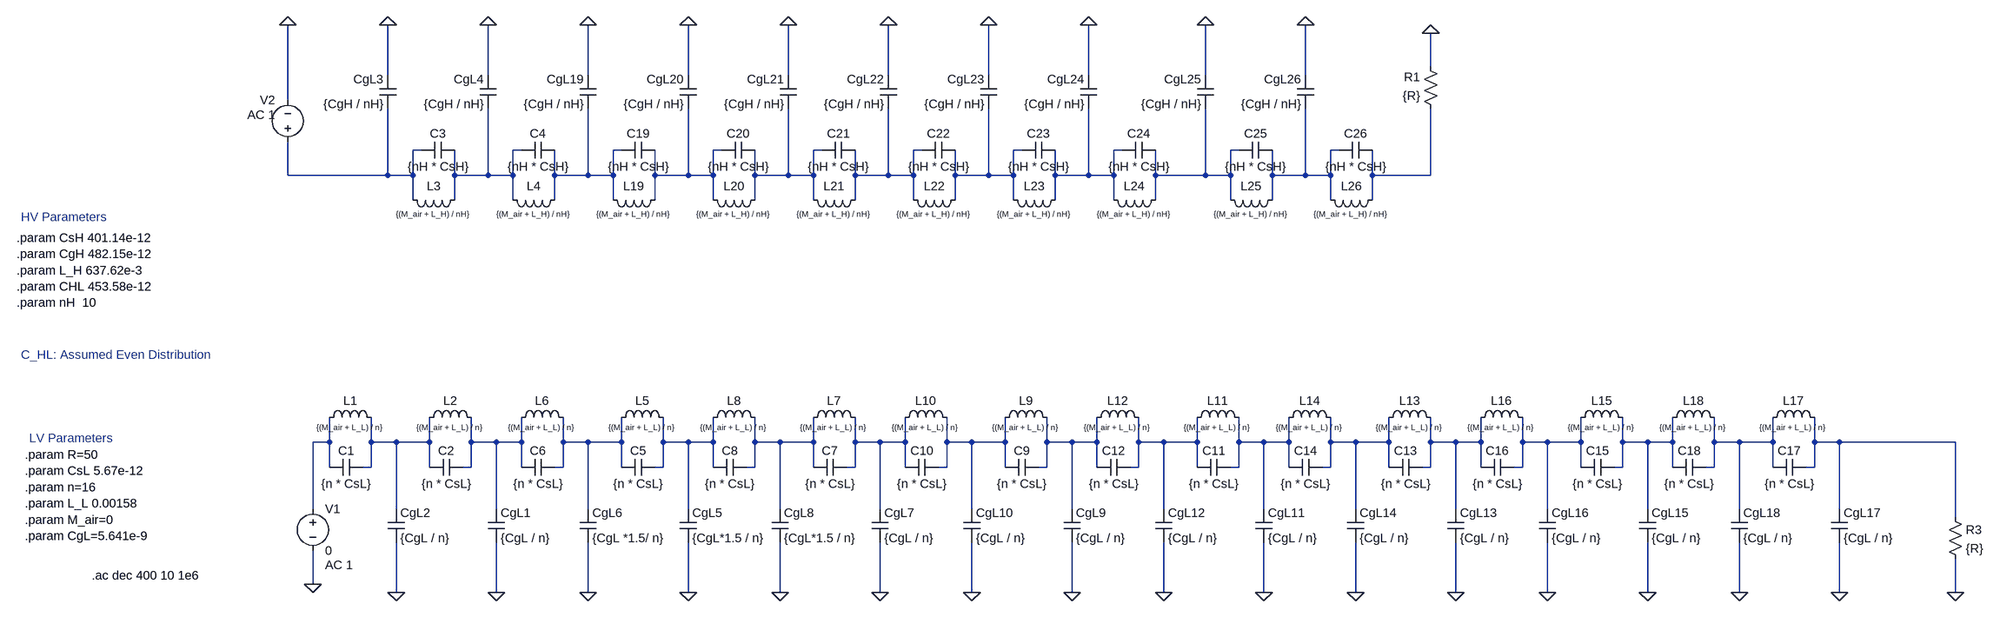
[diagram p0: schematic lumped_network_Radialbase.asc]
lumped_network_Radialbase.asc, the LTspice schematic file:
Version 4.1
SHEET 1 4096 1028
WIRE 2608 -576 2608 -640
WIRE 608 -560 608 -656
WIRE 800 -560 800 -656
WIRE 992 -560 992 -656
WIRE 1184 -560 1184 -656
WIRE 1376 -560 1376 -656
WIRE 1568 -560 1568 -656
WIRE 1760 -560 1760 -656
WIRE 1952 -560 1952 -656
WIRE 2176 -560 2176 -656
WIRE 2368 -560 2368 -656
WIRE 416 -512 416 -656
WIRE 672 -416 656 -416
WIRE 864 -416 848 -416
WIRE 1056 -416 1040 -416
WIRE 1248 -416 1232 -416
WIRE 1440 -416 1424 -416
WIRE 1632 -416 1616 -416
WIRE 1824 -416 1808 -416
WIRE 2016 -416 2000 -416
WIRE 2240 -416 2224 -416
WIRE 2432 -416 2416 -416
WIRE 416 -368 416 -432
WIRE 608 -368 608 -496
WIRE 608 -368 416 -368
WIRE 656 -368 656 -416
WIRE 656 -368 608 -368
WIRE 736 -368 736 -416
WIRE 800 -368 800 -496
WIRE 800 -368 736 -368
WIRE 848 -368 848 -416
WIRE 848 -368 800 -368
WIRE 928 -368 928 -416
WIRE 992 -368 992 -496
WIRE 992 -368 928 -368
WIRE 1040 -368 1040 -416
WIRE 1040 -368 992 -368
WIRE 1120 -368 1120 -416
WIRE 1184 -368 1184 -496
WIRE 1184 -368 1120 -368
WIRE 1232 -368 1232 -416
WIRE 1232 -368 1184 -368
WIRE 1312 -368 1312 -416
WIRE 1376 -368 1376 -496
WIRE 1376 -368 1312 -368
WIRE 1424 -368 1424 -416
WIRE 1424 -368 1376 -368
WIRE 1504 -368 1504 -416
WIRE 1568 -368 1568 -496
WIRE 1568 -368 1504 -368
WIRE 1616 -368 1616 -416
WIRE 1616 -368 1568 -368
WIRE 1696 -368 1696 -416
WIRE 1760 -368 1760 -496
WIRE 1760 -368 1696 -368
WIRE 1808 -368 1808 -416
WIRE 1808 -368 1760 -368
WIRE 1888 -368 1888 -416
WIRE 1952 -368 1952 -496
WIRE 1952 -368 1888 -368
WIRE 2000 -368 2000 -416
WIRE 2000 -368 1952 -368
WIRE 2080 -368 2080 -416
WIRE 2176 -368 2176 -496
WIRE 2176 -368 2080 -368
WIRE 2224 -368 2224 -416
WIRE 2224 -368 2176 -368
WIRE 2304 -368 2304 -416
WIRE 2368 -368 2368 -496
WIRE 2368 -368 2304 -368
WIRE 2416 -368 2416 -416
WIRE 2416 -368 2368 -368
WIRE 2496 -368 2496 -416
WIRE 2608 -368 2608 -496
WIRE 2608 -368 2496 -368
WIRE 656 -320 656 -368
WIRE 736 -320 736 -368
WIRE 848 -320 848 -368
WIRE 928 -320 928 -368
WIRE 1040 -320 1040 -368
WIRE 1120 -320 1120 -368
WIRE 1232 -320 1232 -368
WIRE 1312 -320 1312 -368
WIRE 1424 -320 1424 -368
WIRE 1504 -320 1504 -368
WIRE 1616 -320 1616 -368
WIRE 1696 -320 1696 -368
WIRE 1808 -320 1808 -368
WIRE 1888 -320 1888 -368
WIRE 2000 -320 2000 -368
WIRE 2080 -320 2080 -368
WIRE 2224 -320 2224 -368
WIRE 2304 -320 2304 -368
WIRE 2416 -320 2416 -368
WIRE 2496 -320 2496 -368
WIRE 496 144 496 96
WIRE 496 144 464 144
WIRE 576 144 576 96
WIRE 624 144 576 144
WIRE 688 144 688 96
WIRE 688 144 624 144
WIRE 768 144 768 96
WIRE 816 144 768 144
WIRE 864 144 864 96
WIRE 864 144 816 144
WIRE 944 144 944 96
WIRE 992 144 944 144
WIRE 1056 144 1056 96
WIRE 1056 144 992 144
WIRE 1136 144 1136 96
WIRE 1184 144 1136 144
WIRE 1232 144 1232 96
WIRE 1232 144 1184 144
WIRE 1312 144 1312 96
WIRE 1360 144 1312 144
WIRE 1424 144 1424 96
WIRE 1424 144 1360 144
WIRE 1504 144 1504 96
WIRE 1552 144 1504 144
WIRE 1600 144 1600 96
WIRE 1600 144 1552 144
WIRE 1680 144 1680 96
WIRE 1728 144 1680 144
WIRE 1792 144 1792 96
WIRE 1792 144 1728 144
WIRE 1872 144 1872 96
WIRE 1920 144 1872 144
WIRE 1968 144 1968 96
WIRE 1968 144 1920 144
WIRE 2048 144 2048 96
WIRE 2096 144 2048 144
WIRE 2160 144 2160 96
WIRE 2160 144 2096 144
WIRE 2240 144 2240 96
WIRE 2288 144 2240 144
WIRE 2336 144 2336 96
WIRE 2336 144 2288 144
WIRE 2416 144 2416 96
WIRE 2464 144 2416 144
WIRE 2528 144 2528 96
WIRE 2528 144 2464 144
WIRE 2608 144 2608 96
WIRE 2656 144 2608 144
WIRE 2704 144 2704 96
WIRE 2704 144 2656 144
WIRE 2784 144 2784 96
WIRE 2832 144 2784 144
WIRE 2896 144 2896 96
WIRE 2896 144 2832 144
WIRE 2976 144 2976 96
WIRE 3024 144 2976 144
WIRE 3072 144 3072 96
WIRE 3072 144 3024 144
WIRE 3152 144 3152 96
WIRE 3200 144 3152 144
WIRE 3264 144 3264 96
WIRE 3264 144 3200 144
WIRE 3344 144 3344 96
WIRE 3392 144 3344 144
WIRE 3616 144 3392 144
WIRE 496 192 496 144
WIRE 576 192 576 144
WIRE 576 192 560 192
WIRE 688 192 688 144
WIRE 768 192 768 144
WIRE 768 192 752 192
WIRE 864 192 864 144
WIRE 944 192 944 144
WIRE 944 192 928 192
WIRE 1056 192 1056 144
WIRE 1136 192 1136 144
WIRE 1136 192 1120 192
WIRE 1232 192 1232 144
WIRE 1312 192 1312 144
WIRE 1312 192 1296 192
WIRE 1424 192 1424 144
WIRE 1504 192 1504 144
WIRE 1504 192 1488 192
WIRE 1600 192 1600 144
WIRE 1680 192 1680 144
WIRE 1680 192 1664 192
WIRE 1792 192 1792 144
WIRE 1872 192 1872 144
WIRE 1872 192 1856 192
WIRE 1968 192 1968 144
WIRE 2048 192 2048 144
WIRE 2048 192 2032 192
WIRE 2160 192 2160 144
WIRE 2240 192 2240 144
WIRE 2240 192 2224 192
WIRE 2336 192 2336 144
WIRE 2416 192 2416 144
WIRE 2416 192 2400 192
WIRE 2528 192 2528 144
WIRE 2608 192 2608 144
WIRE 2608 192 2592 192
WIRE 2704 192 2704 144
WIRE 2784 192 2784 144
WIRE 2784 192 2768 192
WIRE 2896 192 2896 144
WIRE 2976 192 2976 144
WIRE 2976 192 2960 192
WIRE 3072 192 3072 144
WIRE 3152 192 3152 144
WIRE 3152 192 3136 192
WIRE 3264 192 3264 144
WIRE 3344 192 3344 144
WIRE 3344 192 3328 192
WIRE 464 272 464 144
WIRE 624 272 624 144
WIRE 816 272 816 144
WIRE 992 272 992 144
WIRE 1184 272 1184 144
WIRE 1360 272 1360 144
WIRE 1552 272 1552 144
WIRE 1728 272 1728 144
WIRE 1920 272 1920 144
WIRE 2096 272 2096 144
WIRE 2288 272 2288 144
WIRE 2464 272 2464 144
WIRE 2656 272 2656 144
WIRE 2832 272 2832 144
WIRE 3024 272 3024 144
WIRE 3200 272 3200 144
WIRE 3392 272 3392 144
WIRE 3616 288 3616 144
WIRE 464 416 464 352
WIRE 624 432 624 336
WIRE 816 432 816 336
WIRE 992 432 992 336
WIRE 1184 432 1184 336
WIRE 1360 432 1360 336
WIRE 1552 432 1552 336
WIRE 1728 432 1728 336
WIRE 1920 432 1920 336
WIRE 2096 432 2096 336
WIRE 2288 432 2288 336
WIRE 2464 432 2464 336
WIRE 2656 432 2656 336
WIRE 2832 432 2832 336
WIRE 3024 432 3024 336
WIRE 3200 432 3200 336
WIRE 3392 432 3392 336
WIRE 3616 432 3616 368
FLAG 816 432 0
FLAG 464 416 0
FLAG 624 432 0
FLAG 1184 432 0
FLAG 992 432 0
FLAG 1552 432 0
FLAG 1360 432 0
FLAG 1920 432 0
FLAG 1728 432 0
FLAG 2288 432 0
FLAG 2096 432 0
FLAG 2656 432 0
FLAG 2464 432 0
FLAG 3024 432 0
FLAG 2832 432 0
FLAG 3392 432 0
FLAG 3200 432 0
FLAG 3616 432 0
FLAG 608 -656 0
FLAG 2608 -640 0
FLAG 800 -656 0
FLAG 992 -656 0
FLAG 1184 -656 0
FLAG 1376 -656 0
FLAG 1568 -656 0
FLAG 1760 -656 0
FLAG 1952 -656 0
FLAG 2176 -656 0
FLAG 2368 -656 0
FLAG 416 -656 0
SYMBOL voltage 464 256 R0
WINDOW 123 24 124 Left 2
WINDOW 39 0 0 Left 0
SYMATTR Value2 AC 1
SYMATTR InstName V1
SYMATTR Value 0
SYMBOL cap 752 176 R90
WINDOW 0 0 32 VBottom 2
WINDOW 3 32 32 VTop 2
SYMATTR InstName C2
SYMATTR Value {n * CsL}
SYMBOL ind 672 112 R270
WINDOW 0 32 56 VTop 2
WINDOW 3 -14 56 VTop 1
SYMATTR InstName L2
SYMATTR Value {(M_air + L_L) / n}
SYMBOL cap 800 272 R0
SYMATTR InstName CgL1
SYMATTR Value {CgL / n}
SYMBOL cap 560 176 R90
WINDOW 0 0 32 VBottom 2
WINDOW 3 32 32 VTop 2
SYMATTR InstName C1
SYMATTR Value {n * CsL}
SYMBOL ind 480 112 R270
WINDOW 0 32 56 VTop 2
WINDOW 3 -14 56 VTop 1
SYMATTR InstName L1
SYMATTR Value {(M_air + L_L) / n}
SYMBOL cap 608 272 R0
SYMATTR InstName CgL2
SYMATTR Value {CgL / n}
SYMBOL cap 1120 176 R90
WINDOW 0 0 32 VBottom 2
WINDOW 3 32 32 VTop 2
SYMATTR InstName C5
SYMATTR Value {n * CsL}
SYMBOL ind 1040 112 R270
WINDOW 0 32 56 VTop 2
WINDOW 3 -14 56 VTop 1
SYMATTR InstName L5
SYMATTR Value {(M_air + L_L) / n}
SYMBOL cap 1168 272 R0
SYMATTR InstName CgL5
SYMATTR Value {CgL*1.5 / n}
SYMBOL cap 928 176 R90
WINDOW 0 0 32 VBottom 2
WINDOW 3 32 32 VTop 2
SYMATTR InstName C6
SYMATTR Value {n * CsL}
SYMBOL ind 848 112 R270
WINDOW 0 32 56 VTop 2
WINDOW 3 -14 56 VTop 1
SYMATTR InstName L6
SYMATTR Value {(M_air + L_L) / n}
SYMBOL cap 976 272 R0
SYMATTR InstName CgL6
SYMATTR Value {CgL *1.5/ n}
SYMBOL cap 1488 176 R90
WINDOW 0 0 32 VBottom 2
WINDOW 3 32 32 VTop 2
SYMATTR InstName C7
SYMATTR Value {n * CsL}
SYMBOL ind 1408 112 R270
WINDOW 0 32 56 VTop 2
WINDOW 3 -14 56 VTop 1
SYMATTR InstName L7
SYMATTR Value {(M_air + L_L) / n}
SYMBOL cap 1536 272 R0
SYMATTR InstName CgL7
SYMATTR Value {CgL / n}
SYMBOL cap 1296 176 R90
WINDOW 0 0 32 VBottom 2
WINDOW 3 32 32 VTop 2
SYMATTR InstName C8
SYMATTR Value {n * CsL}
SYMBOL ind 1216 112 R270
WINDOW 0 32 56 VTop 2
WINDOW 3 -14 56 VTop 1
SYMATTR InstName L8
SYMATTR Value {(M_air + L_L) / n}
SYMBOL cap 1344 272 R0
SYMATTR InstName CgL8
SYMATTR Value {CgL*1.5 / n}
SYMBOL cap 1856 176 R90
WINDOW 0 0 32 VBottom 2
WINDOW 3 32 32 VTop 2
SYMATTR InstName C9
SYMATTR Value {n * CsL}
SYMBOL ind 1776 112 R270
WINDOW 0 32 56 VTop 2
WINDOW 3 -14 56 VTop 1
SYMATTR InstName L9
SYMATTR Value {(M_air + L_L) / n}
SYMBOL cap 1904 272 R0
SYMATTR InstName CgL9
SYMATTR Value {CgL / n}
SYMBOL cap 1664 176 R90
WINDOW 0 0 32 VBottom 2
WINDOW 3 32 32 VTop 2
SYMATTR InstName C10
SYMATTR Value {n * CsL}
SYMBOL ind 1584 112 R270
WINDOW 0 32 56 VTop 2
WINDOW 3 -14 56 VTop 1
SYMATTR InstName L10
SYMATTR Value {(M_air + L_L) / n}
SYMBOL cap 1712 272 R0
SYMATTR InstName CgL10
SYMATTR Value {CgL / n}
SYMBOL cap 2224 176 R90
WINDOW 0 0 32 VBottom 2
WINDOW 3 32 32 VTop 2
SYMATTR InstName C11
SYMATTR Value {n * CsL}
SYMBOL ind 2144 112 R270
WINDOW 0 32 56 VTop 2
WINDOW 3 -14 56 VTop 1
SYMATTR InstName L11
SYMATTR Value {(M_air + L_L) / n}
SYMBOL cap 2272 272 R0
SYMATTR InstName CgL11
SYMATTR Value {CgL / n}
SYMBOL cap 2032 176 R90
WINDOW 0 0 32 VBottom 2
WINDOW 3 32 32 VTop 2
SYMATTR InstName C12
SYMATTR Value {n * CsL}
SYMBOL ind 1952 112 R270
WINDOW 0 32 56 VTop 2
WINDOW 3 -14 56 VTop 1
SYMATTR InstName L12
SYMATTR Value {(M_air + L_L) / n}
SYMBOL cap 2080 272 R0
SYMATTR InstName CgL12
SYMATTR Value {CgL / n}
SYMBOL cap 2592 176 R90
WINDOW 0 0 32 VBottom 2
WINDOW 3 32 32 VTop 2
SYMATTR InstName C13
SYMATTR Value {n * CsL}
SYMBOL ind 2512 112 R270
WINDOW 0 32 56 VTop 2
WINDOW 3 -14 56 VTop 1
SYMATTR InstName L13
SYMATTR Value {(M_air + L_L) / n}
SYMBOL cap 2640 272 R0
SYMATTR InstName CgL13
SYMATTR Value {CgL / n}
SYMBOL cap 2400 176 R90
WINDOW 0 0 32 VBottom 2
WINDOW 3 32 32 VTop 2
SYMATTR InstName C14
SYMATTR Value {n * CsL}
SYMBOL ind 2320 112 R270
WINDOW 0 32 56 VTop 2
WINDOW 3 -14 56 VTop 1
SYMATTR InstName L14
SYMATTR Value {(M_air + L_L) / n}
SYMBOL cap 2448 272 R0
SYMATTR InstName CgL14
SYMATTR Value {CgL / n}
SYMBOL cap 2960 176 R90
WINDOW 0 0 32 VBottom 2
WINDOW 3 32 32 VTop 2
SYMATTR InstName C15
SYMATTR Value {n * CsL}
SYMBOL ind 2880 112 R270
WINDOW 0 32 56 VTop 2
WINDOW 3 -14 56 VTop 1
SYMATTR InstName L15
SYMATTR Value {(M_air + L_L) / n}
SYMBOL cap 3008 272 R0
SYMATTR InstName CgL15
SYMATTR Value {CgL / n}
SYMBOL cap 2768 176 R90
WINDOW 0 0 32 VBottom 2
WINDOW 3 32 32 VTop 2
SYMATTR InstName C16
SYMATTR Value {n * CsL}
SYMBOL ind 2688 112 R270
WINDOW 0 32 56 VTop 2
WINDOW 3 -14 56 VTop 1
SYMATTR InstName L16
SYMATTR Value {(M_air + L_L) / n}
SYMBOL cap 2816 272 R0
SYMATTR InstName CgL16
SYMATTR Value {CgL / n}
SYMBOL cap 3328 176 R90
WINDOW 0 0 32 VBottom 2
WINDOW 3 32 32 VTop 2
SYMATTR InstName C17
SYMATTR Value {n * CsL}
SYMBOL ind 3248 112 R270
WINDOW 0 32 56 VTop 2
WINDOW 3 -14 56 VTop 1
SYMATTR InstName L17
SYMATTR Value {(M_air + L_L) / n}
SYMBOL cap 3376 272 R0
SYMATTR InstName CgL17
SYMATTR Value {CgL / n}
SYMBOL cap 3136 176 R90
WINDOW 0 0 32 VBottom 2
WINDOW 3 32 32 VTop 2
SYMATTR InstName C18
SYMATTR Value {n * CsL}
SYMBOL ind 3056 112 R270
WINDOW 0 32 56 VTop 2
WINDOW 3 -14 56 VTop 1
SYMATTR InstName L18
SYMATTR Value {(M_air + L_L) / n}
SYMBOL cap 3184 272 R0
SYMATTR InstName CgL18
SYMATTR Value {CgL / n}
SYMBOL res 3600 272 R0
SYMATTR InstName R3
SYMATTR Value {R}
SYMBOL res 2624 -480 R180
WINDOW 0 36 76 Left 2
WINDOW 3 36 40 Left 2
SYMATTR InstName R1
SYMATTR Value {R}
SYMBOL cap 672 -400 R270
WINDOW 0 32 32 VTop 2
WINDOW 3 0 32 VBottom 2
SYMATTR InstName C3
SYMATTR Value {nH * CsH}
SYMBOL ind 752 -336 R90
WINDOW 0 5 56 VBottom 2
WINDOW 3 32 56 VTop 1
SYMATTR InstName L3
SYMATTR Value {(M_air + L_H) / nH}
SYMBOL cap 624 -496 R180
WINDOW 0 24 56 Left 2
WINDOW 3 24 8 Left 2
SYMATTR InstName CgL3
SYMATTR Value {CgH / nH}
SYMBOL cap 864 -400 R270
WINDOW 0 32 32 VTop 2
WINDOW 3 0 32 VBottom 2
SYMATTR InstName C4
SYMATTR Value {nH * CsH}
SYMBOL ind 944 -336 R90
WINDOW 0 5 56 VBottom 2
WINDOW 3 32 56 VTop 1
SYMATTR InstName L4
SYMATTR Value {(M_air + L_H) / nH}
SYMBOL cap 816 -496 R180
WINDOW 0 24 56 Left 2
WINDOW 3 24 8 Left 2
SYMATTR InstName CgL4
SYMATTR Value {CgH / nH}
SYMBOL cap 1056 -400 R270
WINDOW 0 32 32 VTop 2
WINDOW 3 0 32 VBottom 2
SYMATTR InstName C19
SYMATTR Value {nH * CsH}
SYMBOL ind 1136 -336 R90
WINDOW 0 5 56 VBottom 2
WINDOW 3 32 56 VTop 1
SYMATTR InstName L19
SYMATTR Value {(M_air + L_H) / nH}
SYMBOL cap 1008 -496 R180
WINDOW 0 24 56 Left 2
WINDOW 3 24 8 Left 2
SYMATTR InstName CgL19
SYMATTR Value {CgH / nH}
SYMBOL cap 1248 -400 R270
WINDOW 0 32 32 VTop 2
WINDOW 3 0 32 VBottom 2
SYMATTR InstName C20
SYMATTR Value {nH * CsH}
SYMBOL ind 1328 -336 R90
WINDOW 0 5 56 VBottom 2
WINDOW 3 32 56 VTop 1
SYMATTR InstName L20
SYMATTR Value {(M_air + L_H) / nH}
SYMBOL cap 1200 -496 R180
WINDOW 0 24 56 Left 2
WINDOW 3 24 8 Left 2
SYMATTR InstName CgL20
SYMATTR Value {CgH / nH}
SYMBOL cap 1440 -400 R270
WINDOW 0 32 32 VTop 2
WINDOW 3 0 32 VBottom 2
SYMATTR InstName C21
SYMATTR Value {nH * CsH}
SYMBOL ind 1520 -336 R90
WINDOW 0 5 56 VBottom 2
WINDOW 3 32 56 VTop 1
SYMATTR InstName L21
SYMATTR Value {(M_air + L_H) / nH}
SYMBOL cap 1392 -496 R180
WINDOW 0 24 56 Left 2
WINDOW 3 24 8 Left 2
SYMATTR InstName CgL21
SYMATTR Value {CgH / nH}
SYMBOL cap 1632 -400 R270
WINDOW 0 32 32 VTop 2
WINDOW 3 0 32 VBottom 2
SYMATTR InstName C22
SYMATTR Value {nH * CsH}
SYMBOL ind 1712 -336 R90
WINDOW 0 5 56 VBottom 2
WINDOW 3 32 56 VTop 1
SYMATTR InstName L22
SYMATTR Value {(M_air + L_H) / nH}
SYMBOL cap 1584 -496 R180
WINDOW 0 24 56 Left 2
WINDOW 3 24 8 Left 2
SYMATTR InstName CgL22
SYMATTR Value {CgH / nH}
SYMBOL cap 1824 -400 R270
WINDOW 0 32 32 VTop 2
WINDOW 3 0 32 VBottom 2
SYMATTR InstName C23
SYMATTR Value {nH * CsH}
SYMBOL ind 1904 -336 R90
WINDOW 0 5 56 VBottom 2
WINDOW 3 32 56 VTop 1
SYMATTR InstName L23
SYMATTR Value {(M_air + L_H) / nH}
SYMBOL cap 1776 -496 R180
WINDOW 0 24 56 Left 2
WINDOW 3 24 8 Left 2
SYMATTR InstName CgL23
SYMATTR Value {CgH / nH}
SYMBOL cap 2016 -400 R270
WINDOW 0 32 32 VTop 2
WINDOW 3 0 32 VBottom 2
SYMATTR InstName C24
SYMATTR Value {nH * CsH}
SYMBOL ind 2096 -336 R90
WINDOW 0 5 56 VBottom 2
WINDOW 3 32 56 VTop 1
SYMATTR InstName L24
SYMATTR Value {(M_air + L_H) / nH}
SYMBOL cap 1968 -496 R180
WINDOW 0 24 56 Left 2
WINDOW 3 24 8 Left 2
SYMATTR InstName CgL24
SYMATTR Value {CgH / nH}
SYMBOL cap 2240 -400 R270
WINDOW 0 32 32 VTop 2
WINDOW 3 0 32 VBottom 2
SYMATTR InstName C25
SYMATTR Value {nH * CsH}
SYMBOL ind 2320 -336 R90
WINDOW 0 5 56 VBottom 2
WINDOW 3 32 56 VTop 1
SYMATTR InstName L25
SYMATTR Value {(M_air + L_H) / nH}
SYMBOL cap 2192 -496 R180
WINDOW 0 24 56 Left 2
WINDOW 3 24 8 Left 2
SYMATTR InstName CgL25
SYMATTR Value {CgH / nH}
SYMBOL cap 2432 -400 R270
WINDOW 0 32 32 VTop 2
WINDOW 3 0 32 VBottom 2
SYMATTR InstName C26
SYMATTR Value {nH * CsH}
SYMBOL ind 2512 -336 R90
WINDOW 0 5 56 VBottom 2
WINDOW 3 32 56 VTop 1
SYMATTR InstName L26
SYMATTR Value {(M_air + L_H) / nH}
SYMBOL cap 2384 -496 R180
WINDOW 0 24 56 Left 2
WINDOW 3 24 8 Left 2
SYMATTR InstName CgL26
SYMATTR Value {CgH / nH}
SYMBOL voltage 416 -416 R180
WINDOW 0 24 96 Left 2
WINDOW 3 24 16 Left 2
WINDOW 123 24 68 Left 2
WINDOW 39 0 0 Left 0
SYMATTR InstName V2
SYMATTR Value ""
SYMATTR Value2 AC 1
TEXT 40 400 Left 2 !.ac dec 400 10 1e6
TEXT -88 168 Left 2 !.param R=50\n.param CsL 5.67e-12\n.param n=16\n.param L_L 0.00158\n.param M_air=0\n.param CgL=5.641e-9
TEXT -104 -248 Left 2 !.param CsH 401.14e-12\n.param CgH 482.15e-12\n.param L_H 637.62e-3\n.param CHL 453.58e-12\n.param nH  10
TEXT -96 -288 Left 2 ;HV Parameters
TEXT -96 -24 Left 2 ;C_HL: Assumed Even Distribution
TEXT -80 136 Left 2 ;LV Parameters

The netlist it stands for:
* lumped_network_Radialbase.asc
V1 N012 0 0 AC 1
C2 N014 N013 {n * CsL}
L2 N013 N014 {(M_air + L_L) / n}
CgL1 N014 0 {CgL / n}
C1 N013 N012 {n * CsL}
L1 N012 N013 {(M_air + L_L) / n}
CgL2 N013 0 {CgL / n}
C5 N016 N015 {n * CsL}
L5 N015 N016 {(M_air + L_L) / n}
CgL5 N016 0 {CgL*1.5 / n}
C6 N015 N014 {n * CsL}
L6 N014 N015 {(M_air + L_L) / n}
CgL6 N015 0 {CgL *1.5/ n}
C7 N018 N017 {n * CsL}
L7 N017 N018 {(M_air + L_L) / n}
CgL7 N018 0 {CgL / n}
C8 N017 N016 {n * CsL}
L8 N016 N017 {(M_air + L_L) / n}
CgL8 N017 0 {CgL*1.5 / n}
C9 N020 N019 {n * CsL}
L9 N019 N020 {(M_air + L_L) / n}
CgL9 N020 0 {CgL / n}
C10 N019 N018 {n * CsL}
L10 N018 N019 {(M_air + L_L) / n}
CgL10 N019 0 {CgL / n}
C11 N022 N021 {n * CsL}
L11 N021 N022 {(M_air + L_L) / n}
CgL11 N022 0 {CgL / n}
C12 N021 N020 {n * CsL}
L12 N020 N021 {(M_air + L_L) / n}
CgL12 N021 0 {CgL / n}
C13 N024 N023 {n * CsL}
L13 N023 N024 {(M_air + L_L) / n}
CgL13 N024 0 {CgL / n}
C14 N023 N022 {n * CsL}
L14 N022 N023 {(M_air + L_L) / n}
CgL14 N023 0 {CgL / n}
C15 N026 N025 {n * CsL}
L15 N025 N026 {(M_air + L_L) / n}
CgL15 N026 0 {CgL / n}
C16 N025 N024 {n * CsL}
L16 N024 N025 {(M_air + L_L) / n}
CgL16 N025 0 {CgL / n}
C17 N028 N027 {n * CsL}
L17 N027 N028 {(M_air + L_L) / n}
CgL17 N028 0 {CgL / n}
C18 N027 N026 {n * CsL}
L18 N026 N027 {(M_air + L_L) / n}
CgL18 N027 0 {CgL / n}
R3 N028 0 {R}
R1 N011 0 {R}
C3 N001 N002 {nH * CsH}
L3 N002 N001 {(M_air + L_H) / nH}
CgL3 N001 0 {CgH / nH}
C4 N002 N003 {nH * CsH}
L4 N003 N002 {(M_air + L_H) / nH}
CgL4 N002 0 {CgH / nH}
C19 N003 N004 {nH * CsH}
L19 N004 N003 {(M_air + L_H) / nH}
CgL19 N003 0 {CgH / nH}
C20 N004 N005 {nH * CsH}
L20 N005 N004 {(M_air + L_H) / nH}
CgL20 N004 0 {CgH / nH}
C21 N005 N006 {nH * CsH}
L21 N006 N005 {(M_air + L_H) / nH}
CgL21 N005 0 {CgH / nH}
C22 N006 N007 {nH * CsH}
L22 N007 N006 {(M_air + L_H) / nH}
CgL22 N006 0 {CgH / nH}
C23 N007 N008 {nH * CsH}
L23 N008 N007 {(M_air + L_H) / nH}
CgL23 N007 0 {CgH / nH}
C24 N008 N009 {nH * CsH}
L24 N009 N008 {(M_air + L_H) / nH}
CgL24 N008 0 {CgH / nH}
C25 N009 N010 {nH * CsH}
L25 N010 N009 {(M_air + L_H) / nH}
CgL25 N009 0 {CgH / nH}
C26 N010 N011 {nH * CsH}
L26 N011 N010 {(M_air + L_H) / nH}
CgL26 N010 0 {CgH / nH}
V2 N001 0 AC 1
.ac dec 400 10 1e6
.param R=50
.param CsL 5.67e-12
.param n=16
.param L_L 0.00158
.param M_air=0
.param CgL=5.641e-9
.param CsH 401.14e-12
.param CgH 482.15e-12
.param L_H 637.62e-3
.param CHL 453.58e-12
.param nH  10
* HV Parameters
* C_HL: Assumed Even Distribution
* LV Parameters
.backanno
.end